# EasyEDA Pro project ProDoc_Schematic.epro

# Schematic Schematic
Board Name: hub_SL2.1A; Create Date: 2025-06-10; Page Name: main; Project Name: almight-hub-2.0; Schematic Name: Schematic; Update Date: 2025-06-10; Company: 嘉立创EDA; Page Size: A3; Version: V1.0
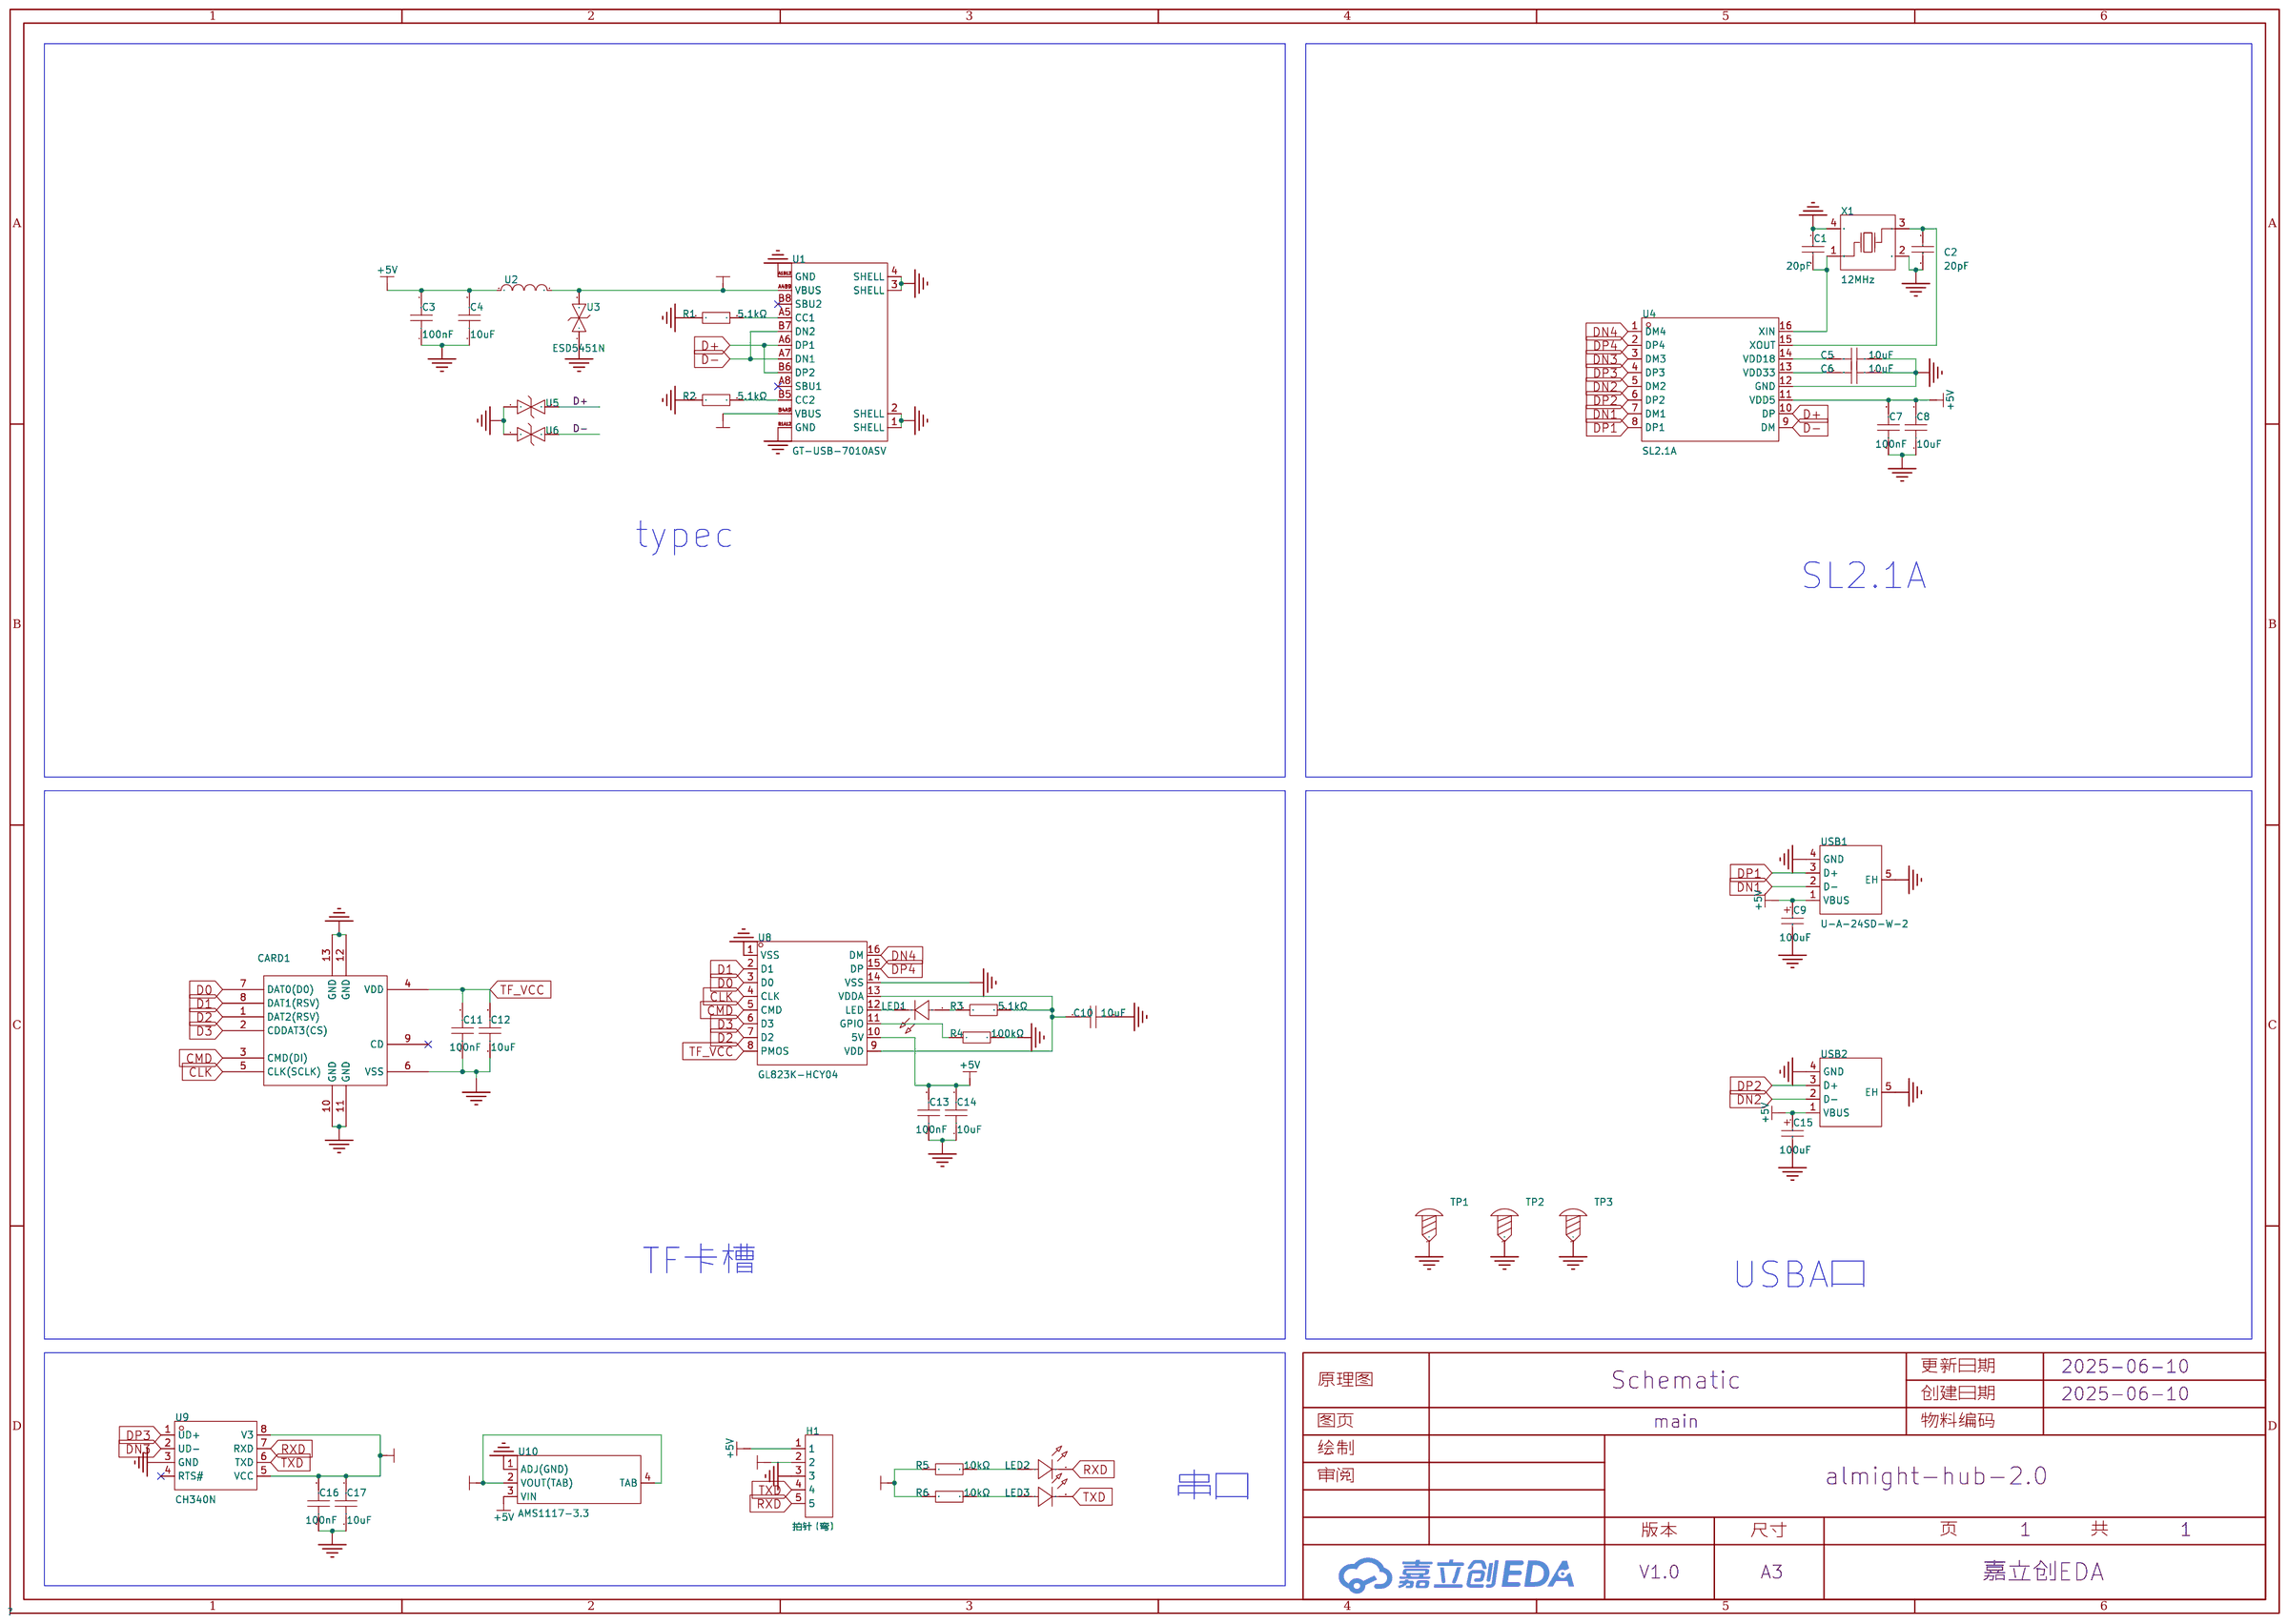
[diagram p0: schematic sheet]

## Parts
C1  20pF  [C0402]
C2  20pF  [C0402]
C3  100nF  [C0402]
C4  10uF  [C0402]
C5  10uF  [C0402]
C6  10uF  [C0402]
C7  100nF  [C0402]
C8  10uF  [C0402]
C9  100uF  [CASE-B_3528]
C10  10uF  [C0402]
C11  100nF  [C0402]
C12  10uF  [C0402]
C13  100nF  [C0402]
C14  10uF  [C0402]
C15  100uF  [CASE-B_3528]
C16  100nF  [C0402]
C17  10uF  [C0402]
CARD1  TF-01A  [TF-SMD_TF-01A]
H1  拍针（弯）  [HDR-TH_5P-P2.54-H-M-W10.4]
LED1  A-SP192DGHC-C01-4T  [LED0603-FD]
LED2  A-SP192DGHC-C01-4T  [LED0603-FD]
LED3  A-SP192DGHC-C01-4T  [LED0603-FD]
R1  5.1kΩ  [R0402]
R2  5.1kΩ  [R0402]
R3  5.1kΩ  [R0402]
R4  100kΩ  [R0402]
R5  10kΩ  [R0402]
R6  10kΩ  [R0402]
TP1  -  [M1螺丝孔]
TP2  -  [M1螺丝孔]
TP3  -  [M1螺丝孔]
U1  GT-USB-7010ASV  [USB-C-SMD_G-SWITCH_GT-USB-7010ASV]
U2  UPZ1608U221-2R2TF  [L0603]
U3  ESD5451N  [DFN1006-2L-BI]
U4  SL2.1A  [SOP-16_L10.0-W3.9-P1.27-LS6.0-BL]
U5  ESD5451N  [DFN1006-2L-BI]
U6  ESD5451N  [DFN1006-2L-BI]
U8  GL823K-HCY04  [SSOP-16_L4.9-W3.9-P0.64-LS6.0-BL]
U9  CH340N  [SOP-8_L5.0-W4.0-P1.27-LS6.0-BL]
U10  AMS1117-3.3  [SOT-223-4_L6.5-W3.5-P2.30-LS7.0-BR]
USB1  U-A-24SD-W-2  [USB-A-SMD_U-A-24SD-W-2]
USB2  U-A-24SD-W-2  [USB-A-SMD_U-A-24SD-W-2]
X1  12MHz  [CRYSTAL-SMD_4P-L3.2-W2.5-BL]

## Library data of the parts
C1 C2 = 0402CG200J500NT: 容值:20pF;精度:±5%;额定电压:50V;材质(温度系数):C0G;; LCSC Part Name: 20pF ±5% 50V; Supplier Part: C1554; Manufacturer: FH(风华); Supplier Footprint: 0402; JLCPCB Part Class: 基础库; Datasheet: https://atta.szlcsc.com/upload/public/pdf/source/20200305/C486355_26A10D38EF8C2A5C37091D0039909270.pdf; Supplier: LCSC; Tolerance: ±5%; Voltage Rated: 50V; Temperature Coefficient: C0G
C3-C8 C10-C14 C16 C17 = HGC0402R5106M100NTEJ: 容值:10uF;精度:±20%;额定电压:10V;材质(温度系数):X5R;; LCSC Part Name: 10uF ±20% 10V; Supplier Part: C7472949; Manufacturer: Chinocera(华瓷); Supplier Footprint: 0402; JLCPCB Part Class: 扩展库; Datasheet: https://atta.szlcsc.com/upload/public/pdf/source/20240320/FAC3FEC40A78BC5CCCE96C232A94D860.pdf; Supplier: LCSC; Tolerance: ±20%; Voltage Rated: 10V; Temperature Coefficient: X5R
C9 C15 = TAJB107K006RNJ: 容值:100uF;精度:±10%;额定电压:6.3V;等效串联电阻(ESR):1.7Ω@100kHz;; LCSC Part Name: 100uF ±10% 6.3V; Supplier Part: C16133; Manufacturer: Kyocera AVX; Supplier Footprint: CASE-B-3528-21(mm); JLCPCB Part Class: 基础库; Supplier: LCSC; Tolerance: ±10%; Voltage Rating: 6.3V; Equivalent Series Resistance(ESR): 1.7Ω@100kHz; Operating Temperature: -55℃~+125℃
CARD1 = TF-01A_C91145: 卡连接方式:自弹式;卡类型:MicroSD卡(TF卡);连接器类型:卡座;本体最大高度:1.85mm;工作温度范围:-;; LCSC Part Name: 自弹式 MicroSD卡(TF卡) 卡座; Supplier Part: C91145; Manufacturer: 韩国韩荣; Supplier Footprint: SMD; JLCPCB Part Class: 扩展库; Datasheet: https://atta.szlcsc.com/upload/public/pdf/source/20190322/C91145_63CBD6FB4639A3A3EC6A9721F18AE0FB.pdf; Supplier: LCSC; Card Connection Mode: 自弹式; Card Type: MicroSD卡(TF卡); Connector Type: 卡座; Supplementary Features: 带定位柱; Maximum Body Height: 1.85mm
H1 = PZ254R-11-05P: 插针结构:1x5P;间距:2.54mm;行距:-;圆针/方针:方针;安装方式:弯插;排数:单排;总PIN位数:5P;额定电流:-;额定电压:-;配合针长度:6mm;塑高:2.5mm;触头材质:黄铜;触头镀层:-;工作温度:-40℃~+105℃;颜色:黑色;; LCSC Part Name: 1x5P 间距:2.54mm 方针 弯插; Supplier Part: C492413; Manufacturer: XFCN(兴飞); Supplier Footprint: 弯插,P=2.54mm; JLCPCB Part Class: 扩展库; Datasheet: https://atta.szlcsc.com/upload/public/pdf/source/20200309/C492413_82088D06BDD816AEC12FB986624DD327.pdf; Supplier: LCSC; Pin Structure: 1x5P; Pitch: 2.54mm; Circluar Pins/Square Pins: 方针; Mounting Type: 弯插; Number of Rows: 单排; Number of Pins: 5P; Length of Mating Pin: 6mm; Insulation Height: 2.5mm; Contact Material: 黄铜; Operating Temperature: -40℃~+105℃; Color: 黑色
LED1-LED3 = A-SP192DGHC-C01-4T: 发光颜色:绿色;正向电压(VF):2.4V~3V;功率:70mW;主波长:520nm~535nm;透镜颜色:无色透明透镜;发光强度:225mcd~450mcd;发光角度:120°;载带方式:正贴;工作温度:-40℃~+85℃;; LCSC Part Name: 0603高亮绿灯正贴; Supplier Part: C19171301; Manufacturer: Amicc(欧密格光电); Supplier Footprint: 0603; JLCPCB Part Class: 扩展库; Datasheet: https://atta.szlcsc.com/upload/public/pdf/source/20231108/CAA90604E374CB6B31BBE970B55159E7.pdf; Supplier: LCSC; Emitted Color: 绿色; Forward Voltage (VF): 2.4V~3V; Power Dissipation: 70mW; Dominant Wavelength: 520nm~535nm; Lens Color: 无色透明透镜; Luminous Intensity: 225mcd~450mcd; Viewing Angle: 120°; Mounting Sytle: 正贴; Operating Temperature: -40℃~+85℃
R1-R6 = RC0402FR-075K1L: 电阻类型:厚膜电阻;阻值:5.1kΩ;精度:±1%;功率:62.5mW;工作电压:50V;温度系数:±100ppm/℃;; LCSC Part Name: 厚膜电阻 5.1kΩ ±1% 62.5mW; Supplier Part: C105872; Manufacturer: YAGEO(国巨); Supplier Footprint: 0402; JLCPCB Part Class: 扩展库; Datasheet: https://atta.szlcsc.com/upload/public/pdf/source/20180821/C275644_0D56F95EFF785E7D9A1FEF436B37DA78.pdf; Supplier: LCSC; Type: 厚膜电阻; Tolerance: ±1%; Power(Watts): 62.5mW; Voltage-Supply(Max): 50V; Temperature Coefficient: ±100ppm/℃; Operating Temperature: -55℃~+155℃
TP1-TP3 = M1螺丝孔
U1 = GT-USB-7010ASV: 连接器类型:Type-C;标准:USB 2.0;公母:母;安装方式:卧贴;触点数量:16P;端口数量:1;额定电流 - 电源:3A;工作温度范围:-40℃~+85℃;; LCSC Part Name: Type-C 母 卧贴; Supplier Part: C2988369; Manufacturer: G-Switch(品赞); Supplier Footprint: SMD; JLCPCB Part Class: 扩展库; Datasheet: https://atta.szlcsc.com/upload/public/pdf/source/20230327/DF227B64686AC8FA0AD1775797F2C3F1.pdf; Supplier: LCSC; Connector Type: Type-C; Standard: USB 2.0; Gender: 母; Mounting Style: 卧贴; Number of Contacts: 16P; Number of Ports: 1; Current Rating - Power (Max): 3A; Rated Voltage (Max): 24V; Connect-Disconnect Life: 1万次; Center Height: 1.68mm; Length: 7.35mm; Core Colour: 黑色; Operating Temperature Range: -40℃~+85℃
U2 = UPZ1608U221-2R2TF: 标称阻抗@测试频率:220Ω@100MHz;误差:±25%;直流电阻(RDC):50mΩ;; LCSC Part Name: 单路 0603磁珠 阻抗220Ω@100MHz; Supplier Part: C279745; Manufacturer: Sunlord(顺络); Supplier Footprint: 0603; JLCPCB Part Class: 扩展库; Datasheet: https://atta.szlcsc.com/upload/public/pdf/source/20231030/6F67BDFA94A48EA93F9ABB358D1D978C.pdf; Supplier: LCSC; Impedance @ Frequency: 220Ω@100MHz; Tolerance: ±25%; DC Resistance: 50mΩ; Current Rating: 2.2A; Circuits: 1
U3 U5 U6 = ESD5451N_C5261080: 极性:双向;反向截止电压(Vrwm):5V;最大钳位电压:9.8V;峰值脉冲电流(Ipp):9A;击穿电压:8V;; LCSC Part Name: 5V 15pF 双向; Supplier Part: C5261080; Manufacturer: HXY MOSFET(华轩阳电子); Supplier Footprint: DFN1006-2L; JLCPCB Part Class: 扩展库; Datasheet: https://atta.szlcsc.com/upload/public/pdf/source/20221111/A08569B01E8721D7410AA31A077C0786.pdf; Supplier: LCSC; polarity: 双向; Reverse Stand-Off Voltage (Vrwm): 5V; Maximum Clamping Voltage: 9.8V; Peak Pulse Current (Ipp): 9A; Breakdown Voltage: 8V; Number of Lines: 单路; Type: ESD
U4 = SL2.1A: SL2.1A是一颗高集成度,高性能,低功耗的USB2.0集线器主控芯片，支持USB2.0高速(480MHz),全速(12MHz)和低速模式(1.5MHz)，内置12MHz晶体振荡器。; LCSC Part Name: USB2.0高速4端口HUB控制器; Supplier Part: C192893; Manufacturer: CoreChips(和芯润德); Supplier Footprint: SOP-16; JLCPCB Part Class: 扩展库; Datasheet: https://atta.szlcsc.com/upload/public/pdf/source/20180522/C192893_624110D24898D57AAC785E3DF98EA862.pdf; Supplier: LCSC
U8 = GL823K-HCY04: 应用功能:-;接口协议:-;; LCSC Part Name: USB 2.0 SD/MSPRO 卡读取控制器; Supplier Part: C284879; Manufacturer: GENESYS(创惟); Supplier Footprint: SSOP-16-150mil; JLCPCB Part Class: 扩展库; Datasheet: https://atta.szlcsc.com/upload/public/pdf/source/20190212/C284879_D3054E8AA735401C3047DCECFFFED6D3.pdf; Supplier: LCSC
U9 = CH340N_C506813: 应用功能:USB转串口;接口协议:USB 2.0;通道数:-;数据速率:2Mbps;; LCSC Part Name: USB转串口芯片CH340; Supplier Part: C506813; Manufacturer: WCH(南京沁恒); Supplier Footprint: SOP-8; JLCPCB Part Class: 扩展库; Datasheet: https://atta.szlcsc.com/upload/public/pdf/source/20200819/C84681_ADBED554CE321879DBD6B1D06488689C.pdf; Supplier: LCSC; Applications Function: USB转串口; Protocol: USB 2.0; Supply Voltage: 3.3V；5V; Data Rate: 2Mbps; Operating Temperature: -20℃~+70℃
U10 = AMS1117-3.3_C347222: 输出类型:固定;工作电压:12V;输出电压:3.3V;输出电流:1A;电源纹波抑制比(PSRR):60dB@(120Hz);输出极性:正极;; LCSC Part Name: 输出:3.3V 电流:1A 耐压:12V; Supplier Part: C347222; Manufacturer: UMW(友台半导体); Supplier Footprint: SOT-223; JLCPCB Part Class: 扩展库; Datasheet: https://atta.szlcsc.com/upload/public/pdf/source/20241218/BAF0263FA2E44BCD8AF41AA4FA04EFAA.pdf; Supplier: LCSC; Output Type: 固定; Voltage - Supply: 12V; Output Voltage: 3.3V; Output Current: 1A; Power Supply Rejection Ratio (PSRR): 60dB@(120Hz); Voltage Dropout: 1.3V@(1A); Features: 过流保护; Output Configuration: 正极; Number of Outputs: 1
USB1 USB2 = U-A-24SD-W-2: 连接器类型:Type-A;标准:USB 2.0;公母:母;端口数量:1;触点数量:4P;安装方式:沉板;额定电流 - 电源:1.5A;工作温度范围:-;; LCSC Part Name: Type-A 母 沉板; Supplier Part: C2689986; Manufacturer: 韩国韩荣; Supplier Footprint: SMD; JLCPCB Part Class: 扩展库; Datasheet: https://atta.szlcsc.com/upload/public/pdf/source/20210322/C2689986_F704F76FA1B937E04E3A7380B93AAA3B.pdf; Supplier: LCSC; Connector Type: Type-A; Standard: USB 2.0; Gender: 母; Number of Ports: 1; Number of Contacts: 4P; Mounting Style: 沉板; Current Rating - Power (Max): 1.5A
X1 = X322512MSB4SI: 晶振类型:贴片晶振;频率:12MHz;常温频差:±10ppm;外接负载电容:20pF;频率稳定度(全温):±20ppm;; LCSC Part Name: 12MHz ±10ppm 20pF; Supplier Part: C9002; Manufacturer: YXC(扬兴晶振); Supplier Footprint: SMD3225-4P; JLCPCB Part Class: 基础库; Datasheet: https://atta.szlcsc.com/upload/public/pdf/source/20240329/19D5F850207469550BEB00D7DFEDBC7A.pdf; Supplier: LCSC; Crystal Type: 贴片晶振; Normal temperature Frequency Tolerance: ±10ppm; External load capacitor: 20pF; Frequency Stability(Full temperature range): ±20ppm; Operating Temperature: -40℃~+85℃

## Nets
3V3: C16.2 C17.2 H1.2 R5.1 R6.1 U9.5(VCC) U9.8(V3) U10.2(VOUT(TAB)) U10.4(TAB)
+5V: C3.2 C4.2 C7.2 C8.2 C9.1 C13.2 C14.2 C15.1 H1.1 U2.1 U4.11(VDD5) U8.10(5V) U10.3(VIN) USB1.1(VBUS) USB2.1(VBUS)
GND: C1.1 C2.2 C3.1 C4.1 C5.1 C6.1 C7.1 C8.1 C9.2 C10.2 C11.1 C12.1 C13.1 C14.1 C15.2 C16.1 C17.1 CARD1.6(VSS) CARD1.10(GND) CARD1.11(GND) CARD1.12(GND) CARD1.13(GND) H1.3 R1.1 R2.1 R4.2 TP1.1 TP2.1 TP3.1 U1.1(SHELL) U1.2(SHELL) U1.3(SHELL) U1.4(SHELL) U1.A1B12(GND) U1.B1A12(GND) U3.1 U4.12(GND) U5.1 U6.1 U8.1(VSS) U8.14(VSS) U9.3(GND) U10.1(ADJ(GND)) USB1.4(GND) USB1.5(EH) USB2.4(GND) USB2.5(EH) X1.2(GND) X1.4(GND)
VBUS: U1.A4B9(VBUS) U1.B4A9(VBUS) U2.2 U3.2
CLK: CARD1.5(CLK(SCLK)) U8.4(CLK)
CMD: CARD1.3(CMD(DI)) U8.5(CMD)
D0: CARD1.7(DAT0(D0)) U8.3(D0)
D1: CARD1.8(DAT1(RSV)) U8.2(D1)
D2: CARD1.1(DAT2(RSV)) U8.7(D2)
D3: CARD1.2(CDDAT3(CS)) U8.6(D3)
D+: U1.A6(DP1) U1.B6(DP2) U4.10(DP) U5.2
D-: U1.A7(DN1) U1.B7(DN2) U4.9(DM) U6.2
DN1: U4.7(DM1) USB1.2(D-)
DN2: U4.5(DM2) USB2.2(D-)
DN3: U4.3(DM3) U9.2(UD-)
DN4: U4.1(DM4) U8.16(DM)
DP1: U4.8(DP1) USB1.3(D+)
DP2: U4.6(DP2) USB2.3(D+)
DP3: U4.4(DP3) U9.1(UD+)
DP4: U4.2(DP4) U8.15(DP)
RXD: H1.5 LED2.2(K) U9.7(RXD)
TF_VCC: C11.2 C12.2 CARD1.4(VDD) U8.8(PMOS)
TXD: H1.4 LED3.2(K) U9.6(TXD)
Net-(C1-2): C1.2 U4.16(XIN) X1.1(OSC1)
Net-(C2-1): C2.1 U4.15(XOUT) X1.3(OSC2)
Net-(C5-2): C5.2 U4.14(VDD18)
Net-(C6-2): C6.2 U4.13(VDD33)
Net-(C10-1): C10.1 R3.2 U8.9(VDD) U8.13(VDDA)
Net-(LED1-1): LED1.1(A) R3.1
Net-(LED1-2): LED1.2(K) U8.12(LED)
Net-(LED2-1): LED2.1(A) R5.2
Net-(LED3-1): LED3.1(A) R6.2
Net-(R1-2): R1.2 U1.A5(CC1)
Net-(R2-2): R2.2 U1.B5(CC2)
Net-(R4-1): R4.1 U8.11(GPIO)

Not connected (* = marked no-connect by the designer): CARD1 9(CD)*; U1 A8(SBU1)* B8(SBU2)*; U9 4(RTS#)*

## Notes on the sheet
- typec
- SL2.1A
- TF卡槽
- USBA口
- 串口
